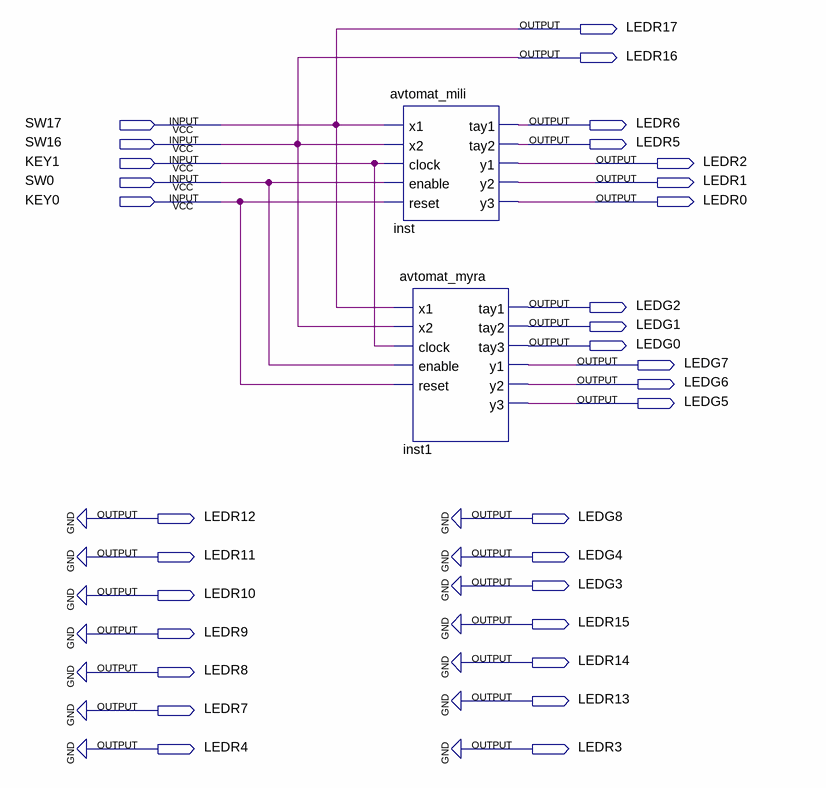
[diagram p0: schematic sheet]
// Quartus schematic maket_avt.bdf as structural Verilog: 2 symbols, 32 pins
module maket_avt (
  input  SW17,
  input  SW16,
  input  KEY1,
  input  SW0,
  input  KEY0,
  output LEDR17,
  output LEDR16,
  output LEDR6,
  output LEDR5,
  output LEDR2,
  output LEDR1,
  output LEDR0,
  output LEDG2,
  output LEDG1,
  output LEDG0,
  output LEDG7,
  output LEDG6,
  output LEDG5,
  output LEDR12,
  output LEDG8,
  output LEDR11,
  output LEDG4,
  output LEDG3,
  output LEDR10,
  output LEDR15,
  output LEDR9,
  output LEDR14,
  output LEDR8,
  output LEDR13,
  output LEDR7,
  output LEDR4,
  output LEDR3
);

  avtomat_mili inst (
    .x1(SW17), .x2(SW16), .clock(KEY1), .enable(SW0), .reset(KEY0), .tay1(LEDR6), .tay2(LEDR5), .y1(LEDR2),
    .y2(LEDR1), .y3(LEDR0));
  avtomat_myra inst1 (
    .x1(SW17), .x2(SW16), .clock(KEY1), .enable(SW0), .reset(KEY0), .tay1(LEDG2), .tay2(LEDG1), .tay3(LEDG0),
    .y1(LEDG7), .y2(LEDG6), .y3(LEDG5));

  assign LEDG3 = 1'b0;
  assign LEDG4 = 1'b0;
  assign LEDG8 = 1'b0;
  assign LEDR3 = 1'b0;
  assign LEDR4 = 1'b0;
  assign LEDR7 = 1'b0;
  assign LEDR8 = 1'b0;
  assign LEDR9 = 1'b0;
  assign LEDR10 = 1'b0;
  assign LEDR11 = 1'b0;
  assign LEDR12 = 1'b0;
  assign LEDR13 = 1'b0;
  assign LEDR14 = 1'b0;
  assign LEDR15 = 1'b0;
  assign LEDR16 = SW16;
  assign LEDR17 = SW17;
endmodule
